# Altium schematic sheet MAIN.SchDoc
size A3
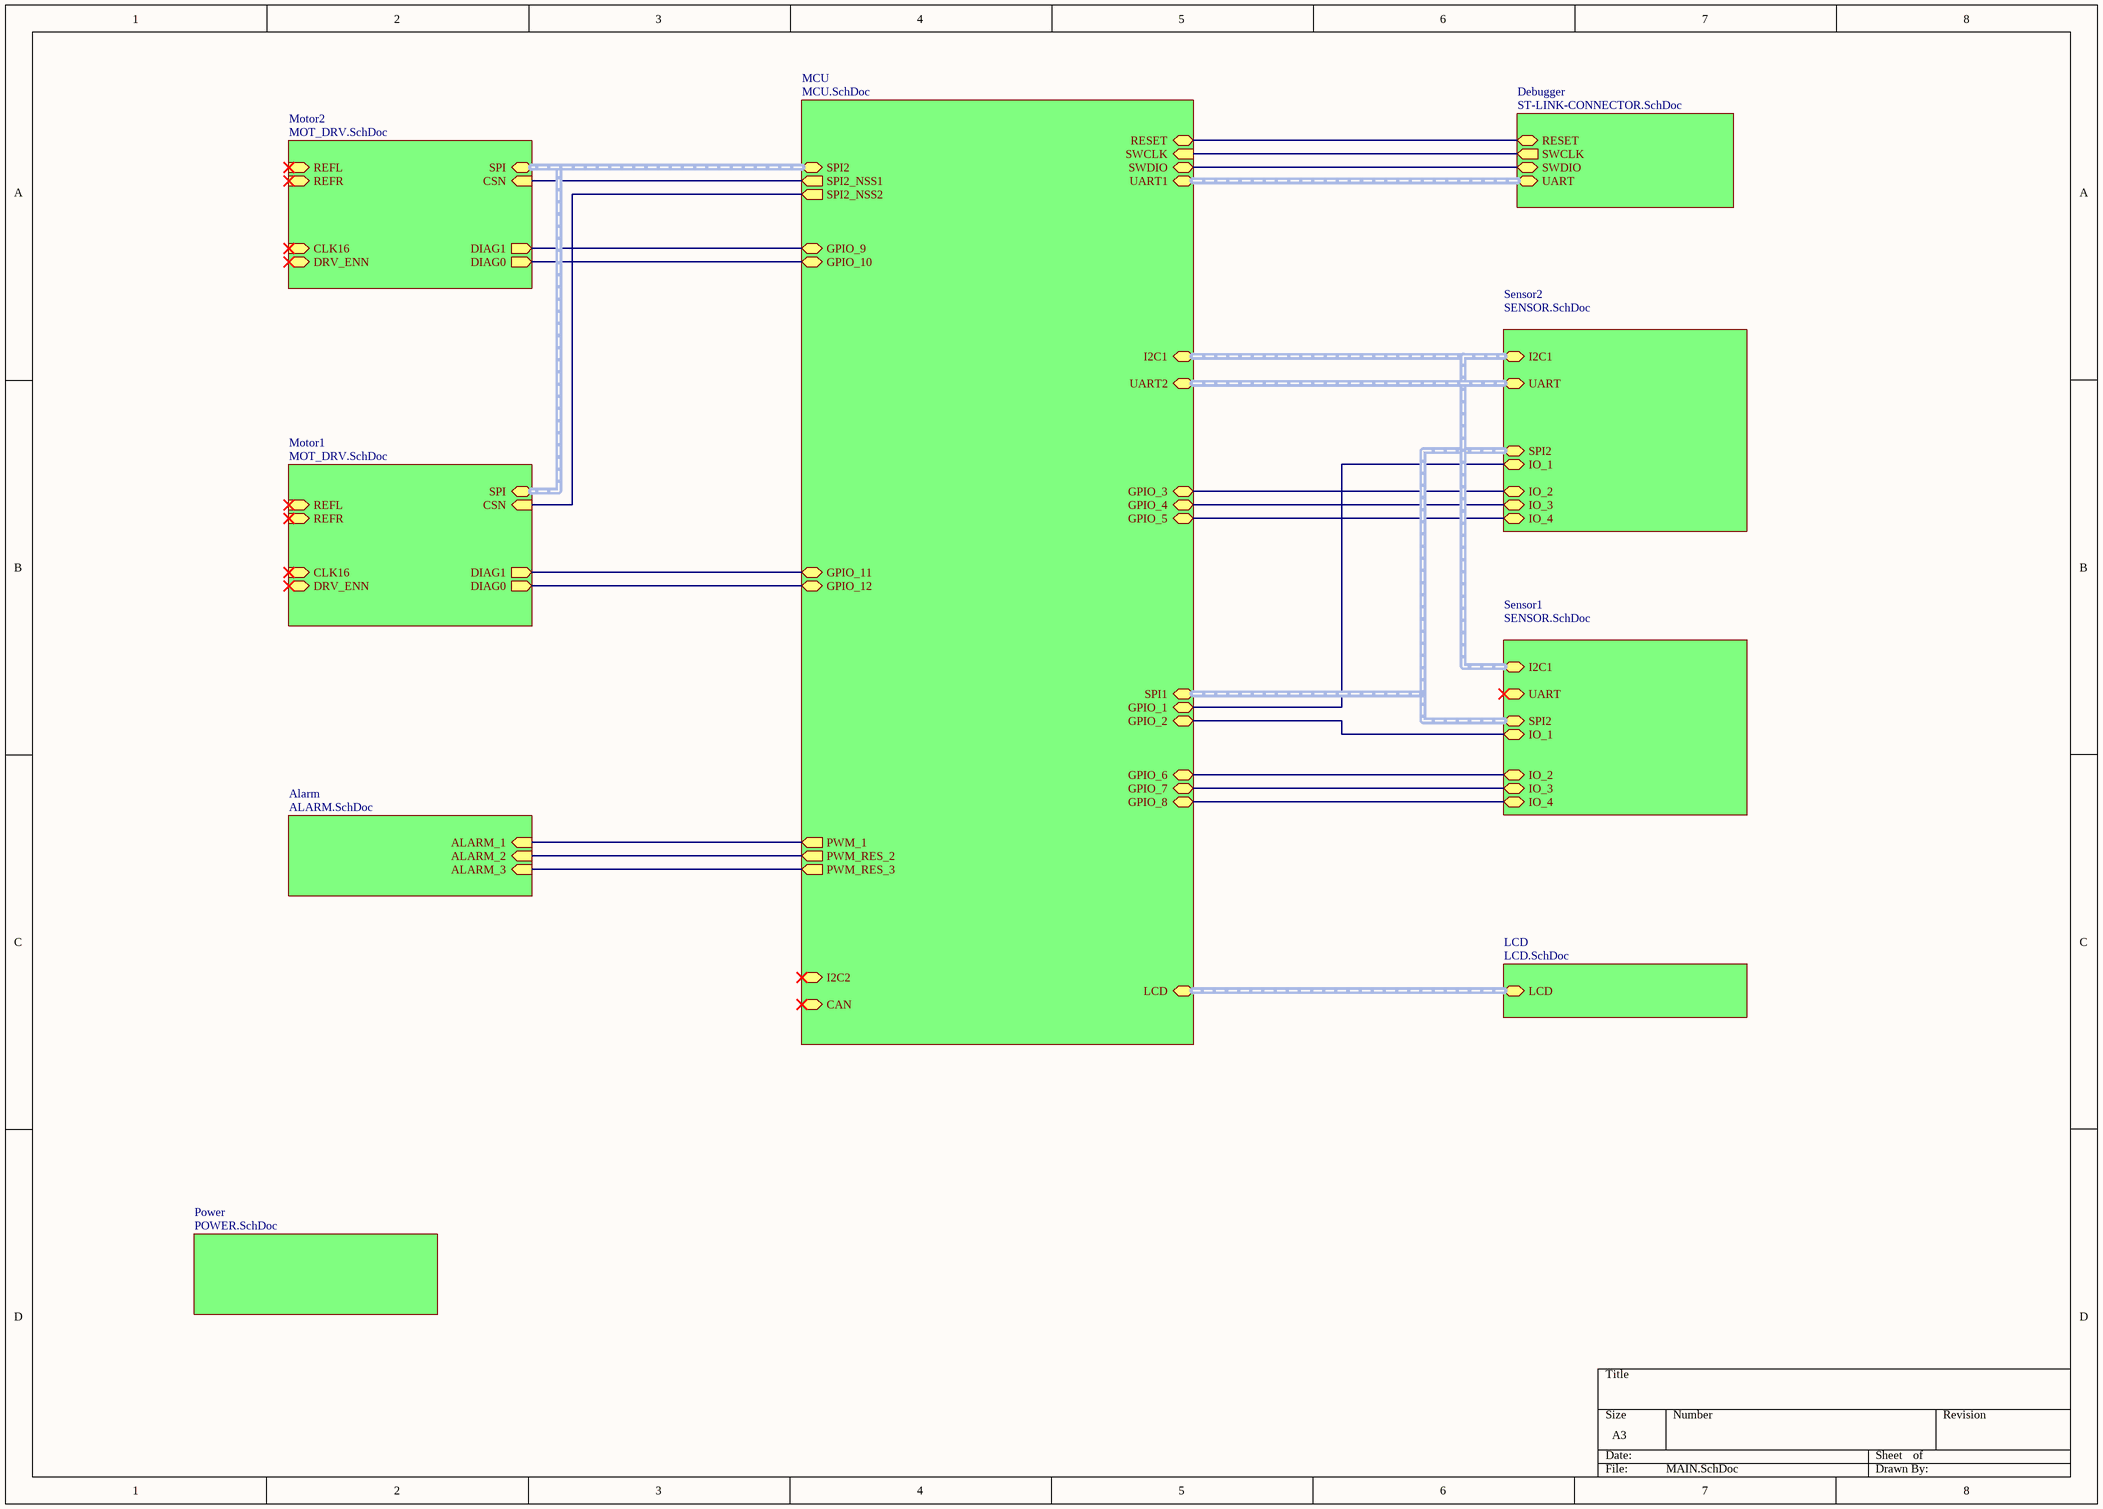
[diagram p0: MAIN.SchDoc]

## Sub-sheets
Alarm = ALARM.SchDoc: ALARM_3 (in), ALARM_1 (in), ALARM_2 (in)
Debugger = ST-LINK-CONNECTOR.SchDoc: SWDIO (bidir), SWCLK (out), RESET, UART (harness UART)
LCD = LCD.SchDoc: LCD (harness LCD)
MCU = MCU.SchDoc: UART1 (harness UART), UART2 (harness UART), GPIO_7, CAN (harness CAN), GPIO_1, GPIO_5, RESET, SWCLK (in), GPIO_2, SWDIO (bidir), SPI2 (harness SPI), SPI1 (harness SPI), GPIO_6, GPIO_12, GPIO_3, GPIO_9, I2C1 (harness I2C), I2C2 (harness I2C), GPIO_11, LCD (harness LCD), GPIO_8, GPIO_4, GPIO_10, PWM_1 (out), PWM_RES_2 (out), PWM_RES_3 (out), SPI2_NSS1 (out), SPI2_NSS2 (out)
Motor1 = MOT_DRV.SchDoc: DRV_ENN, DIAG1 (out), REFR (in), DIAG0 (out), CLK16 (in), REFL (in), CSN (in), SPI (harness SPI)
Motor2 = MOT_DRV.SchDoc: DRV_ENN, DIAG1 (out), REFR (in), DIAG0 (out), CLK16 (in), REFL (in), CSN (in), SPI (harness SPI)
Power = POWER.SchDoc: no entries
Sensor1 = SENSOR.SchDoc: I2C1 (harness I2C), UART (harness UART), SPI2 (harness SPI), IO_2, IO_1, IO_3, IO_4
Sensor2 = SENSOR.SchDoc: I2C1 (harness I2C), UART (harness UART), SPI2 (harness SPI), IO_2, IO_1, IO_3, IO_4

## Nets
(unnamed): sheet MCU/GPIO_7, sheet Sensor1/IO_3
(unnamed): sheet MCU/GPIO_1, sheet Sensor2/IO_1
(unnamed): sheet MCU/GPIO_5, sheet Sensor2/IO_4
(unnamed): sheet MCU/RESET, sheet Debugger/RESET
(unnamed): sheet MCU/SWCLK, sheet Debugger/SWCLK
(unnamed): sheet MCU/GPIO_2, sheet Sensor1/IO_1
(unnamed): sheet MCU/SWDIO, sheet Debugger/SWDIO
(unnamed): sheet MCU/GPIO_6, sheet Sensor1/IO_2
(unnamed): sheet MCU/GPIO_12, sheet Motor1/DIAG0
(unnamed): sheet MCU/GPIO_3, sheet Sensor2/IO_2
(unnamed): sheet MCU/GPIO_9, sheet Motor2/DIAG1
(unnamed): sheet MCU/GPIO_11, sheet Motor1/DIAG1
(unnamed): sheet MCU/GPIO_8, sheet Sensor1/IO_4
(unnamed): sheet MCU/GPIO_4, sheet Sensor2/IO_3
(unnamed): sheet MCU/GPIO_10, sheet Motor2/DIAG0
(unnamed): sheet MCU/PWM_1, sheet Alarm/ALARM_1
(unnamed): sheet MCU/PWM_RES_2, sheet Alarm/ALARM_2
(unnamed): sheet MCU/PWM_RES_3, sheet Alarm/ALARM_3
(unnamed): sheet MCU/SPI2_NSS1, sheet Motor2/CSN
(unnamed): sheet MCU/SPI2_NSS2, sheet Motor1/CSN

## Buses and harness runs
harness sheet Debugger/UART = sheet MCU/UART1
harness sheet LCD/LCD = sheet MCU/LCD
harness sheet MCU/I2C1 = sheet Sensor1/I2C1 = sheet Sensor2/I2C1
harness sheet MCU/SPI1 = sheet Sensor1/SPI2 = sheet Sensor2/SPI2
harness sheet MCU/SPI2 = sheet Motor1/SPI = sheet Motor2/SPI
harness sheet MCU/UART2 = sheet Sensor2/UART